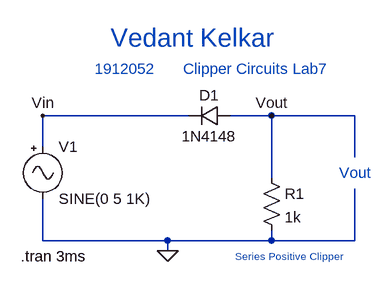
[diagram p0: schematic Draft16.asc]
Draft16.asc, the LTspice schematic file:
Version 4
SHEET 1 1172 680
WIRE 192 208 -32 208
WIRE 320 208 256 208
WIRE 448 208 320 208
WIRE -32 256 -32 208
WIRE 448 272 448 208
WIRE 320 304 320 208
WIRE -32 400 -32 336
WIRE 160 400 -32 400
WIRE 320 400 320 384
WIRE 320 400 160 400
WIRE 448 400 448 320
WIRE 448 400 320 400
WIRE 160 416 160 400
FLAG -32 208 Vin
FLAG 320 208 Vout
FLAG 160 416 0
SYMBOL Misc\\signal -32 240 R0
WINDOW 123 0 0 Left 0
WINDOW 39 0 0 Left 0
SYMATTR InstName V1
SYMATTR Value SINE(0 5 1K)
SYMBOL diode 256 192 R90
WINDOW 0 0 32 VBottom 2
WINDOW 3 32 32 VTop 2
SYMATTR InstName D1
SYMATTR Value 1N4148
SYMBOL res 304 288 R0
SYMATTR InstName R1
SYMATTR Value 1k
TEXT 72 88 Left 4 ;Vedant Kelkar
TEXT 48 136 Left 2 ;1912052
TEXT 184 136 Left 2 ;Clipper Circuits Lab7
TEXT 424 296 Left 2 ;Vout
TEXT 264 424 Left 1 ;Series Positive Clipper
TEXT -66 424 Left 2 !.tran 3ms

The netlist it stands for:
* Draft16.asc
V1 Vin 0 SINE(0 5 1K)
D1 Vout Vin 1N4148
R1 Vout 0 1k
.model D D
.lib standard.dio
* Vedant Kelkar
* 1912052
* Clipper Circuits Lab7
* Vout
* Series Positive Clipper
.tran 3ms
.backanno
.end